# EAGLE design mainboard (EAGLE 9.6.2)
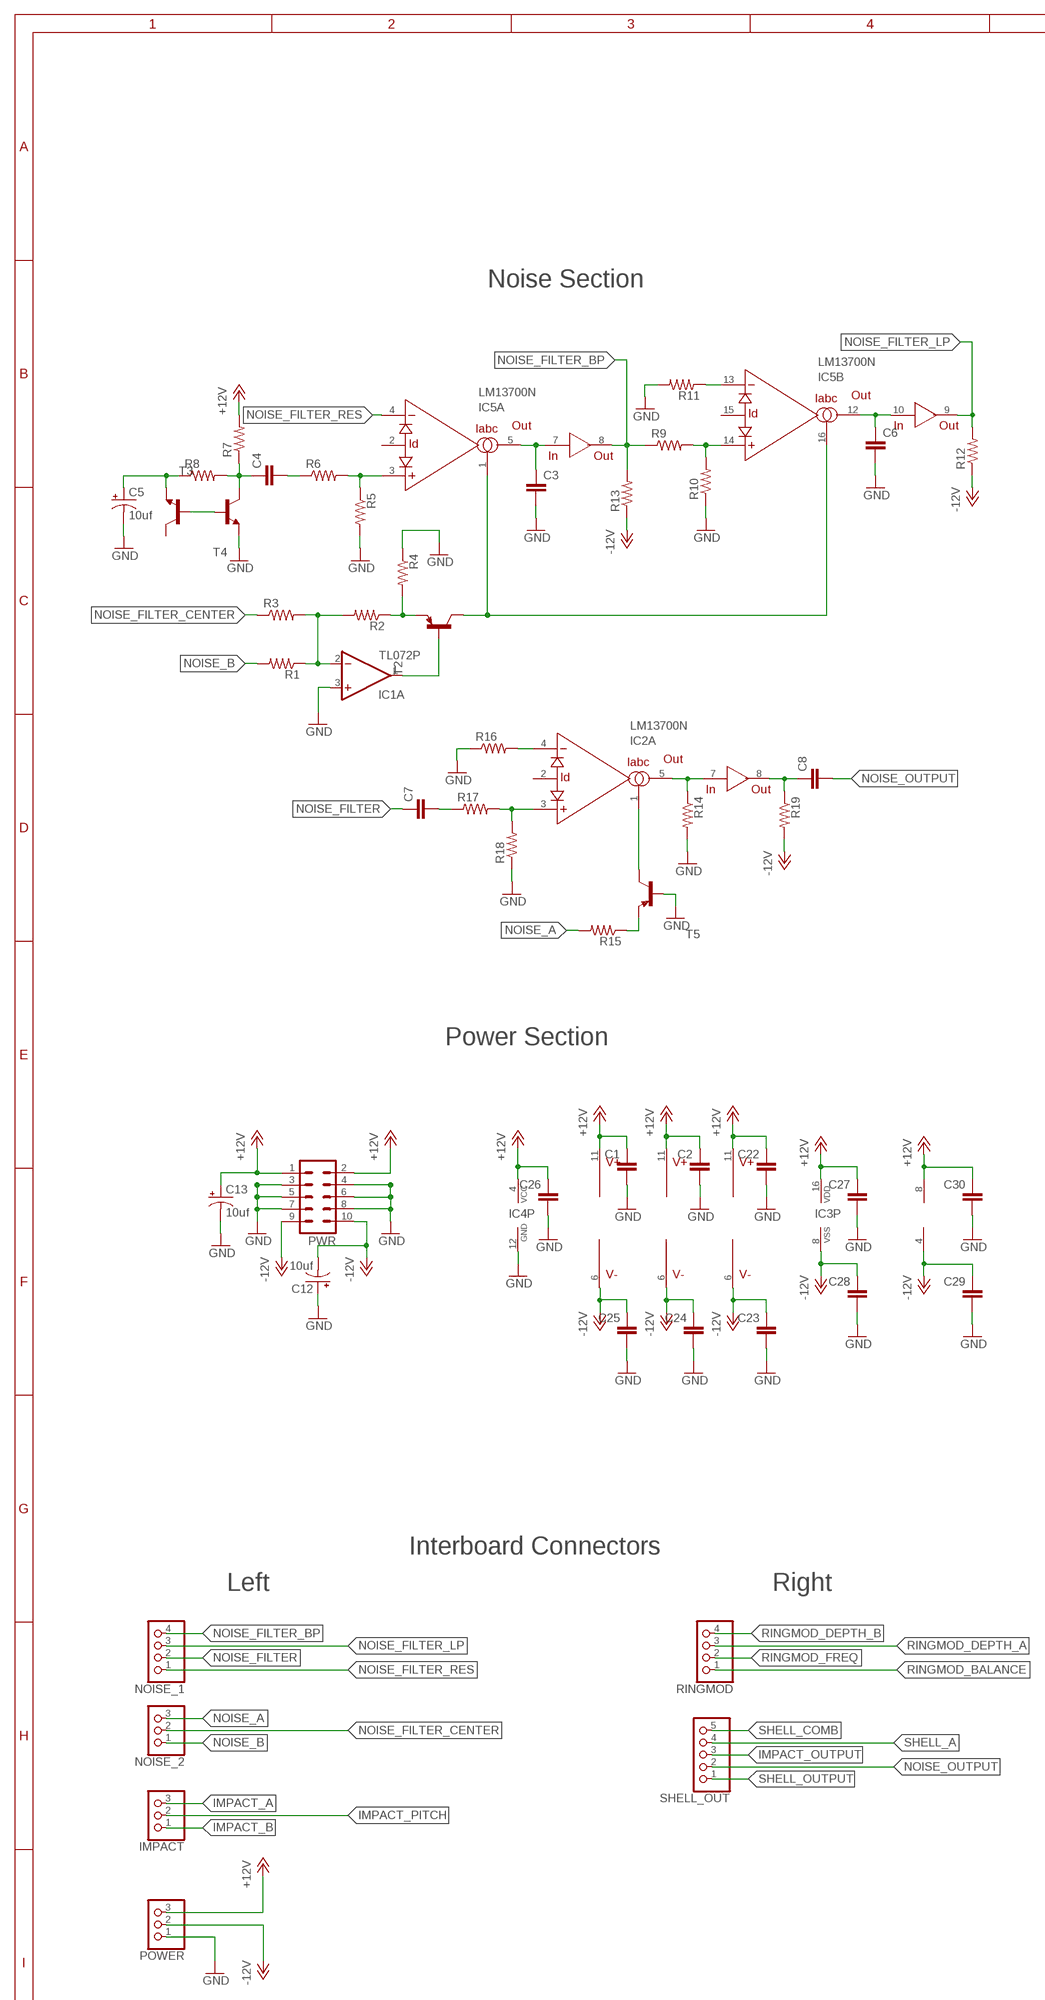
[diagram p0: schematic, sheet 1, part 1 of 2]
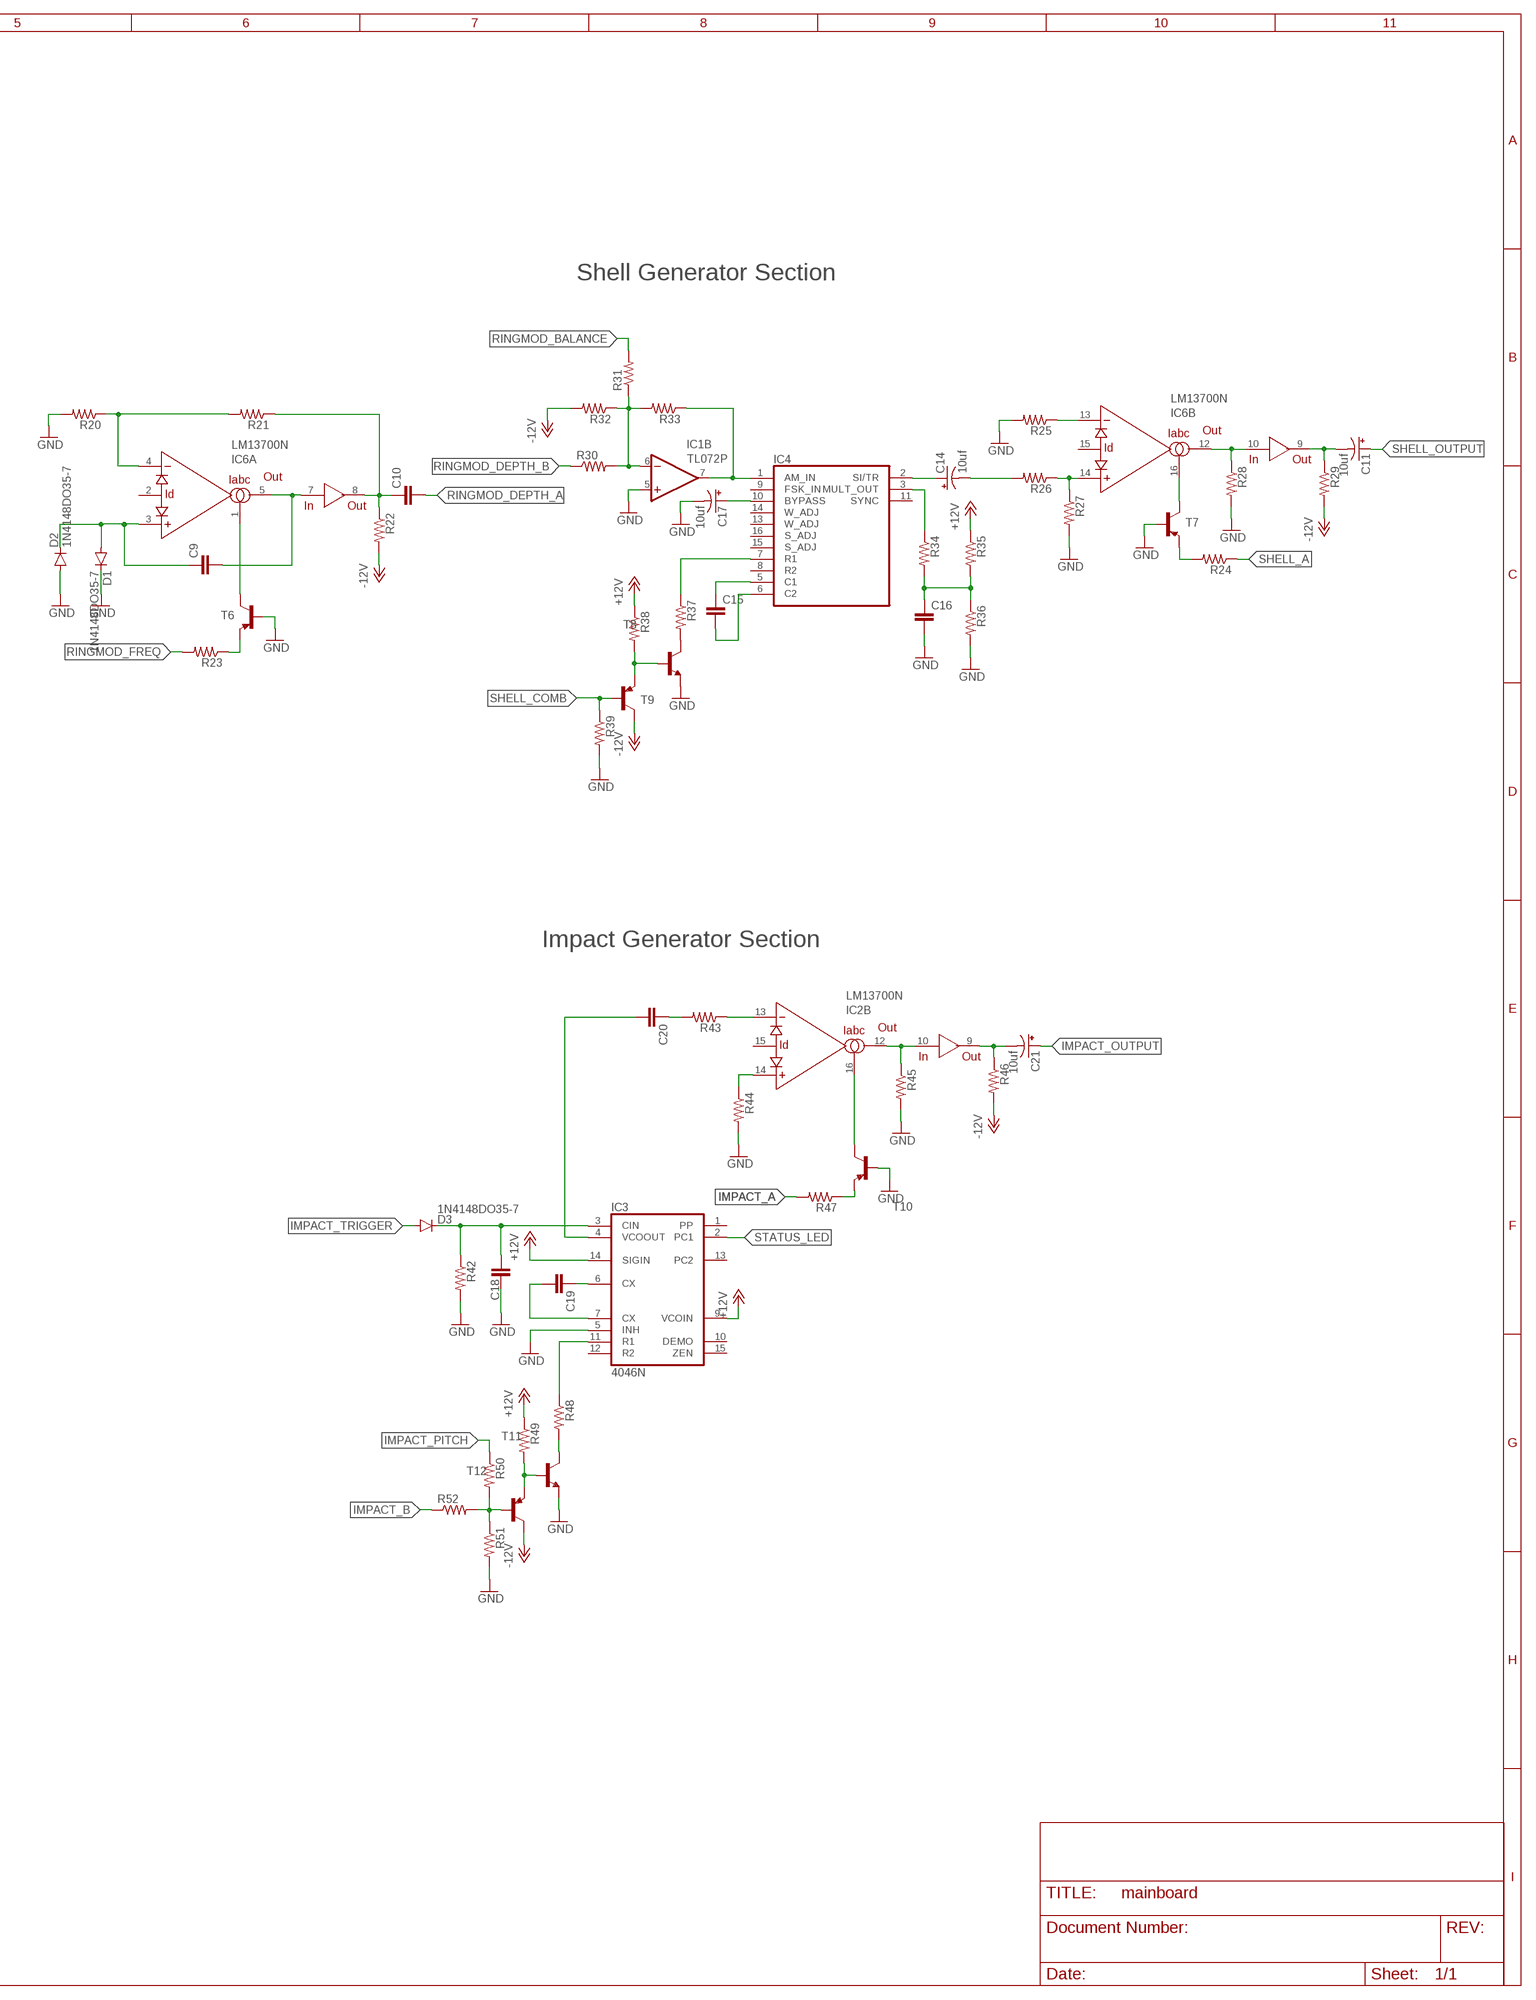
[diagram p1: schematic, sheet 1, part 2 of 2]

## Parts
C1  C-EU050-024X044  [C050-024X044]
C2  C-EU050-024X044  [C050-024X044]
C3  C-EU050-024X044  [C050-024X044]
C4  C-EU050-024X044  [C050-024X044]
C5  10uf  CPOL-USE2.5-5  [E2,5-5]
C6  C-EU050-024X044  [C050-024X044]
C7  C-EU050-024X044  [C050-024X044]
C8  C-EU050-024X044  [C050-024X044]
C9  C-EU050-024X044  [C050-024X044]
C10  C-EU050-024X044  [C050-024X044]
C11  10uf  CPOL-USE2.5-5  [E2,5-5]
C12  10uf  CPOL-USE2.5-5  [E2,5-5]
C13  10uf  CPOL-USE2.5-5  [E2,5-5]
C14  10uf  CPOL-USE2.5-5  [E2,5-5]
C15  C-EU050-024X044  [C050-024X044]
C16  C-EU050-024X044  [C050-024X044]
C17  10uf  CPOL-USE2.5-5  [E2,5-5]
C18  C-EU050-024X044  [C050-024X044]
C19  C-EU050-024X044  [C050-024X044]
C20  C-EU050-024X044  [C050-024X044]
C21  10uf  CPOL-USE2.5-5  [E2,5-5]
C22  C-EU050-024X044  [C050-024X044]
C23  C-EU050-024X044  [C050-024X044]
C24  C-EU050-024X044  [C050-024X044]
C25  C-EU050-024X044  [C050-024X044]
C26  C-EU050-024X044  [C050-024X044]
C27  C-EU050-024X044  [C050-024X044]
C28  C-EU050-024X044  [C050-024X044]
C29  C-EU050-024X044  [C050-024X044]
C30  C-EU050-024X044  [C050-024X044]
D1  1N4148DO35-7  [DO35-7]
D2  1N4148DO35-7  [DO35-7]
D3  1N4148DO35-7  [DO35-7]
IC1  TL072P  [DIL08]
IC2  LM13700N  [DIL16]
IC3  4046N  [DIL16]
IC4  XR-2206  [DIL16]
IC5  LM13700N  [DIL16]
IC6  LM13700N  [DIL16]
IMPACT  PINHD-1X3  [1X03]
NOISE_1  PINHD-1X4  [1X04]
NOISE_2  PINHD-1X3  [1X03]
POWER  PINHD-1X3  [1X03]
PWR  ML10  [ML10]
R1  R-US_0207/7  [0207/7]
R2  R-US_0207/7  [0207/7]
R3  R-US_0207/7  [0207/7]
R4  R-US_0207/7  [0207/7]
R5  R-US_0207/7  [0207/7]
R6  R-US_0207/7  [0207/7]
R7  R-US_0207/7  [0207/7]
R8  R-US_0207/7  [0207/7]
R9  R-US_0207/7  [0207/7]
R10  R-US_0207/7  [0207/7]
R11  R-US_0207/7  [0207/7]
R12  R-US_0207/7  [0207/7]
R13  R-US_0207/7  [0207/7]
R14  R-US_0207/7  [0207/7]
R15  R-US_0207/7  [0207/7]
R16  R-US_0207/7  [0207/7]
R17  R-US_0207/7  [0207/7]
R18  R-US_0207/7  [0207/7]
R19  R-US_0207/7  [0207/7]
R20  R-US_0207/7  [0207/7]
R21  R-US_0207/7  [0207/7]
R22  R-US_0207/7  [0207/7]
R23  R-US_0207/7  [0207/7]
R24  R-US_0207/7  [0207/7]
R25  R-US_0207/7  [0207/7]
R26  R-US_0207/7  [0207/7]
R27  R-US_0207/7  [0207/7]
R28  R-US_0207/7  [0207/7]
R29  R-US_0207/7  [0207/7]
R30  R-US_0207/7  [0207/7]
R31  R-US_0207/7  [0207/7]
R32  R-US_0207/7  [0207/7]
R33  R-US_0207/7  [0207/7]
R34  R-US_0207/7  [0207/7]
R35  R-US_0207/7  [0207/7]
R36  R-US_0207/7  [0207/7]
R37  R-US_0207/7  [0207/7]
R38  R-US_0207/7  [0207/7]
R39  R-US_0207/7  [0207/7]
R42  R-US_0207/7  [0207/7]
R43  R-US_0207/7  [0207/7]
R44  R-US_0207/7  [0207/7]
R45  R-US_0207/7  [0207/7]
R46  R-US_0207/7  [0207/7]
R47  R-US_0207/7  [0207/7]
R48  R-US_0207/7  [0207/7]
R49  R-US_0207/7  [0207/7]
R50  R-US_0207/7  [0207/7]
R51  R-US_0207/7  [0207/7]
R52  R-US_0207/7  [0207/7]
RINGMOD  PINHD-1X4  [1X04]
SHELL_OUT  PINHD-1X5  [1X05]
T2  2N3906-PNP-TO92-EBC  [TO92-EBC]
T3  2N3904-NPN-TO92-EBC  [TO92-EBC]
T4  2N3904-NPN-TO92-EBC  [TO92-EBC]
T5  2N3906-PNP-TO92-EBC  [TO92-EBC]
T6  2N3906-PNP-TO92-EBC  [TO92-EBC]
T7  2N3906-PNP-TO92-EBC  [TO92-EBC]
T8  2N3904-NPN-TO92-EBC  [TO92-EBC]
T9  2N3906-PNP-TO92-EBC  [TO92-EBC]
T10  2N3906-PNP-TO92-EBC  [TO92-EBC]
T11  2N3904-NPN-TO92-EBC  [TO92-EBC]
T12  2N3906-PNP-TO92-EBC  [TO92-EBC]

## Nets
+12V: C1.1 C2.1 C13.+ C22.1 C26.1 C27.1 C30.1 IC1.8(P:V+) IC2.11(V+) IC3.9(VCOIN) IC3.14(SIGIN) IC3.16(VDD) IC4.4(VCC) IC5.11(V+) IC6.11(V+) POWER.3 PWR.1 PWR.2 R7.2 R35.1 R38.1 R49.1
-12V: C12.- C23.1 C24.1 C25.1 C28.1 C29.1 IC1.4(P:V-) IC2.6(V-) IC3.8(VSS) IC5.6(V-) IC6.6(V-) POWER.2 PWR.9 PWR.10 R12.1 R13.1 R19.2 R22.2 R29.2 R32.2 R46.2 T9.C T12.C
GND: C1.2 C2.2 C3.2 C5.- C6.2 C12.+ C13.- C16.2 C17.- C18.1 C22.2 C23.2 C24.2 C25.2 C26.2 C27.2 C28.2 C29.2 C30.2 D1.C D2.A IC1.3(A:+IN) IC1.5(B:+IN) IC3.5(INH) IC4.12(GND) POWER.1 PWR.3 PWR.4 PWR.5 PWR.6 PWR.7 PWR.8 R4.1 R5.2 R10.1 R11.2 R14.2 R16.1 R18.1 R20.2 R25.2 R27.2 R28.2 R36.2 R39.2 R42.2 R44.2 R45.2 R51.2 T3.E T5.B T6.B T7.B T8.E T10.B T11.E
IMPACT_A: IMPACT.3 R47.2
IMPACT_B: IMPACT.1 R52.1
IMPACT_OUTPUT: C21.+ SHELL_OUT.3
IMPACT_PITCH: IMPACT.2 R50.1
IMPACT_TRIGGER: D3.A
N$1: IC1.2(A:-IN) R1.1 R2.2 R3.2
N$2: IC5.1(A:IABC) IC5.16(B:IABC) T2.C
N$3: IC1.1(A:OUT) T2.B
N$6: R2.1 R4.2 T2.E
N$7: C3.1 IC5.5(A:OUT) IC5.7(IN)
N$8: C5.+ R8.1 T4.E
N$9: C4.1 R7.1 R8.2 T3.C
N$10: T3.B T4.B
N$11: C4.2 R6.1
N$12: IC5.3(A:+IN) R5.1 R6.2
N$14: C6.1 IC5.10(IN) IC5.12(B:OUT)
N$16: IC5.14(B:+IN) R9.2 R10.2
N$17: IC5.13(B:-IN) R11.1
N$19: IC2.4(A:-IN) R16.2
N$20: IC2.3(A:+IN) R17.2 R18.2
N$21: C7.2 R17.1
N$23: IC2.1(A:IABC) T5.C
N$24: C9.1 D1.A D2.C IC6.3(A:+IN)
N$25: R15.1 T5.E
N$27: IC2.5(A:OUT) IC2.7(IN) R14.1
N$28: C8.1 IC2.8(OUT) R19.1
N$30: C9.2 IC6.5(A:OUT) IC6.7(IN)
N$31: C10.1 IC6.8(OUT) R21.1 R22.1
N$33: IC6.1(A:IABC) T6.C
N$34: R23.1 T6.E
N$35: IC6.4(A:-IN) R20.1 R21.2
N$38: IC1.6(B:-IN) R30.2 R31.1 R32.1 R33.2
N$40: IC1.7(B:OUT) IC4.1(AM_IN) R33.1
N$41: C14.+ IC4.2(SI/TR)
N$42: C14.- R26.2
N$43: IC6.14(B:+IN) R26.1 R27.1
N$44: IC6.13(B:-IN) R25.1
N$45: IC6.16(B:IABC) T7.C
N$46: IC6.10(IN) IC6.12(B:OUT) R28.1
N$47: R24.2 T7.E
N$49: C11.- IC6.9(OUT) R29.1
N$50: C15.2 IC4.6(C2)
N$52: C15.1 IC4.5(C1)
N$53: IC4.3(MULT_OUT) R34.1
N$54: C17.+ IC4.10(BYPASS)
N$55: C16.1 R34.2 R35.2 R36.1
N$56: IC4.7(R1) R37.1
N$57: R37.2 T8.C
N$59: R38.2 T8.B T9.E
N$62: C20.1 R43.2
N$63: IC2.13(B:-IN) R43.1
N$64: IC2.14(B:+IN) R44.1
N$65: IC2.10(IN) IC2.12(B:OUT) R45.1
N$66: IC2.16(B:IABC) T10.C
N$67: R50.2 R51.1 R52.2 T12.B
N$68: R47.1 T10.E
N$70: C21.- IC2.9(OUT) R46.1
N$72: C20.2 IC3.4(VCOOUT)
N$73: C19.1 IC3.6(CX)
N$74: C19.2 IC3.7(CX)
N$75: R49.2 T11.B T12.E
N$76: C18.2 D3.C IC3.3(CIN) R42.1
N$78: R48.2 T11.C
N$80: IC3.11(R1) R48.1
NOISE_A: NOISE_2.3 R15.2
NOISE_B: NOISE_2.1 R1.2
NOISE_FILTER: C7.1 NOISE_1.2
NOISE_FILTER_BP: IC5.8(OUT) NOISE_1.4 R9.1 R13.2
NOISE_FILTER_CENTER: NOISE_2.2 R3.1
NOISE_FILTER_LP: IC5.9(OUT) NOISE_1.3 R12.2
NOISE_FILTER_RES: IC5.4(A:-IN) NOISE_1.1
NOISE_OUTPUT: C8.2 SHELL_OUT.2
RINGMOD_BALANCE: R31.2 RINGMOD.1
RINGMOD_DEPTH_A: C10.2 RINGMOD.3
RINGMOD_DEPTH_B: R30.1 RINGMOD.4
RINGMOD_FREQ: R23.2 RINGMOD.2
SHELL_A: R24.1 SHELL_OUT.4
SHELL_COMB: R39.1 SHELL_OUT.5 T9.B
SHELL_OUTPUT: C11.+ SHELL_OUT.1
STATUS_LED: IC3.2(PC1)
Unconnected: IC2.2(A:ID) IC2.15(B:ID) IC3.1(PP) IC3.10(DEMO) IC3.12(R2) IC3.13(PC2) IC3.15(ZEN) IC4.8(R2) IC4.9(FSK_IN) IC4.11(SYNC) IC4.13(W_ADJ) IC4.14(W_ADJ) IC4.15(S_ADJ) IC4.16(S_ADJ) IC5.2(A:ID) IC5.15(B:ID) IC6.2(A:ID) IC6.15(B:ID) T4.C

## Notes on the sheet
- Noise Section | Shell Generator Section
- Impact Generator Section
- Power Section
- Interboard Connectors
- Left | Right

## Library data of the parts
C1-C4 C6-C10 C15 C16 C18-C20 C22-C30 = rcl:C-EU: CAPACITOR, European symbol; SPICEPREFIX: C
C5 C11-C14 C17 C21 = resistor:CPOL-US: POLARIZED CAPACITOR, American symbol
D1-D3 = diode:1N4148: DIODE high speed (Philips)
IC1 = TomW:TL072: OP AMP
IC2 IC5 IC6 = synthdiy:LM13700: National Dual OTA with buffers.
IC3 = 40xx:4046: Micropower PLL
IC4 = exar:XR-2206: Monolithic FUNCTION GENERATOR; OC_FARNELL: unknown; OC_NEWARK: unknown
IMPACT NOISE_2 POWER = pinhead:PINHD-1X3: PIN HEADER
NOISE_1 RINGMOD = pinhead:PINHD-1X4: PIN HEADER
PWR = con-ml:ML10: HARTING; OC_FARNELL: unknown; OC_NEWARK: unknown
R1-R39 R42-R52 = rcl:R-US_: RESISTOR, American symbol; SPICEPREFIX: R
SHELL_OUT = pinhead:PINHD-1X5: PIN HEADER
T2 T5-T7 T9 T10 T12 = transistor-neu-to92:*-PNP-: PNP Transistror
T3 T4 T8 T11 = transistor-neu-to92:*-NPN-: NPN Transistror

## Board
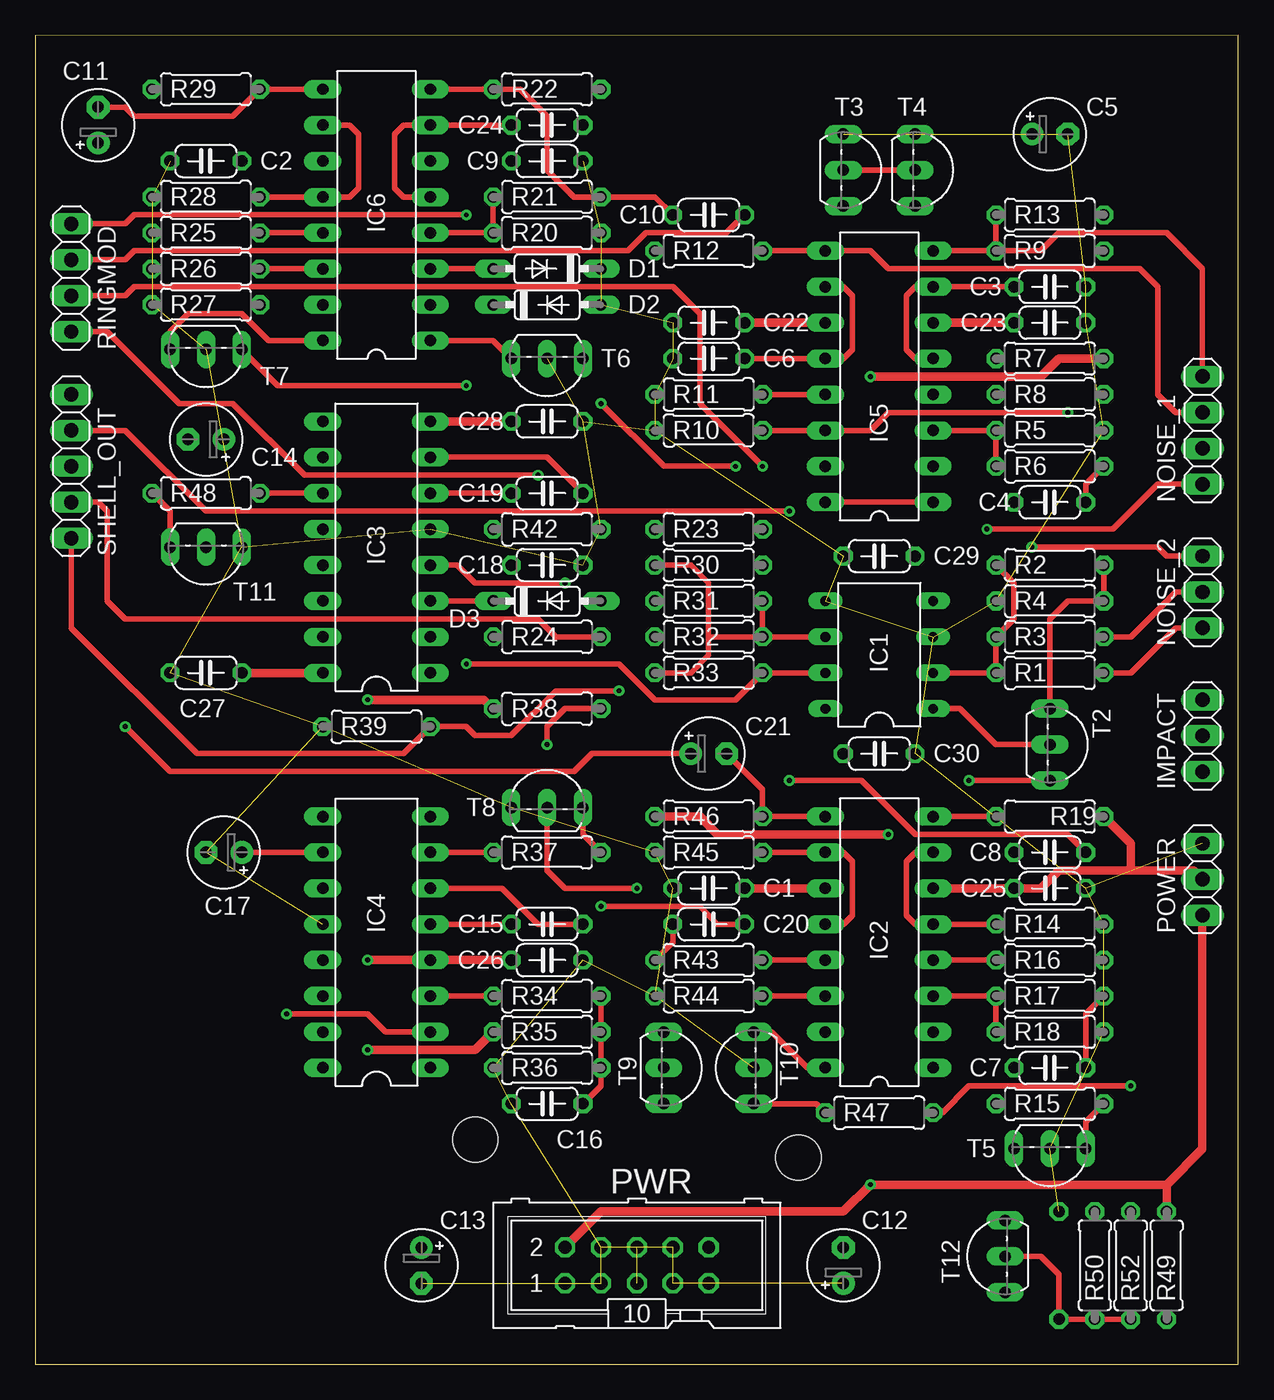
[diagram p2: board, top side]
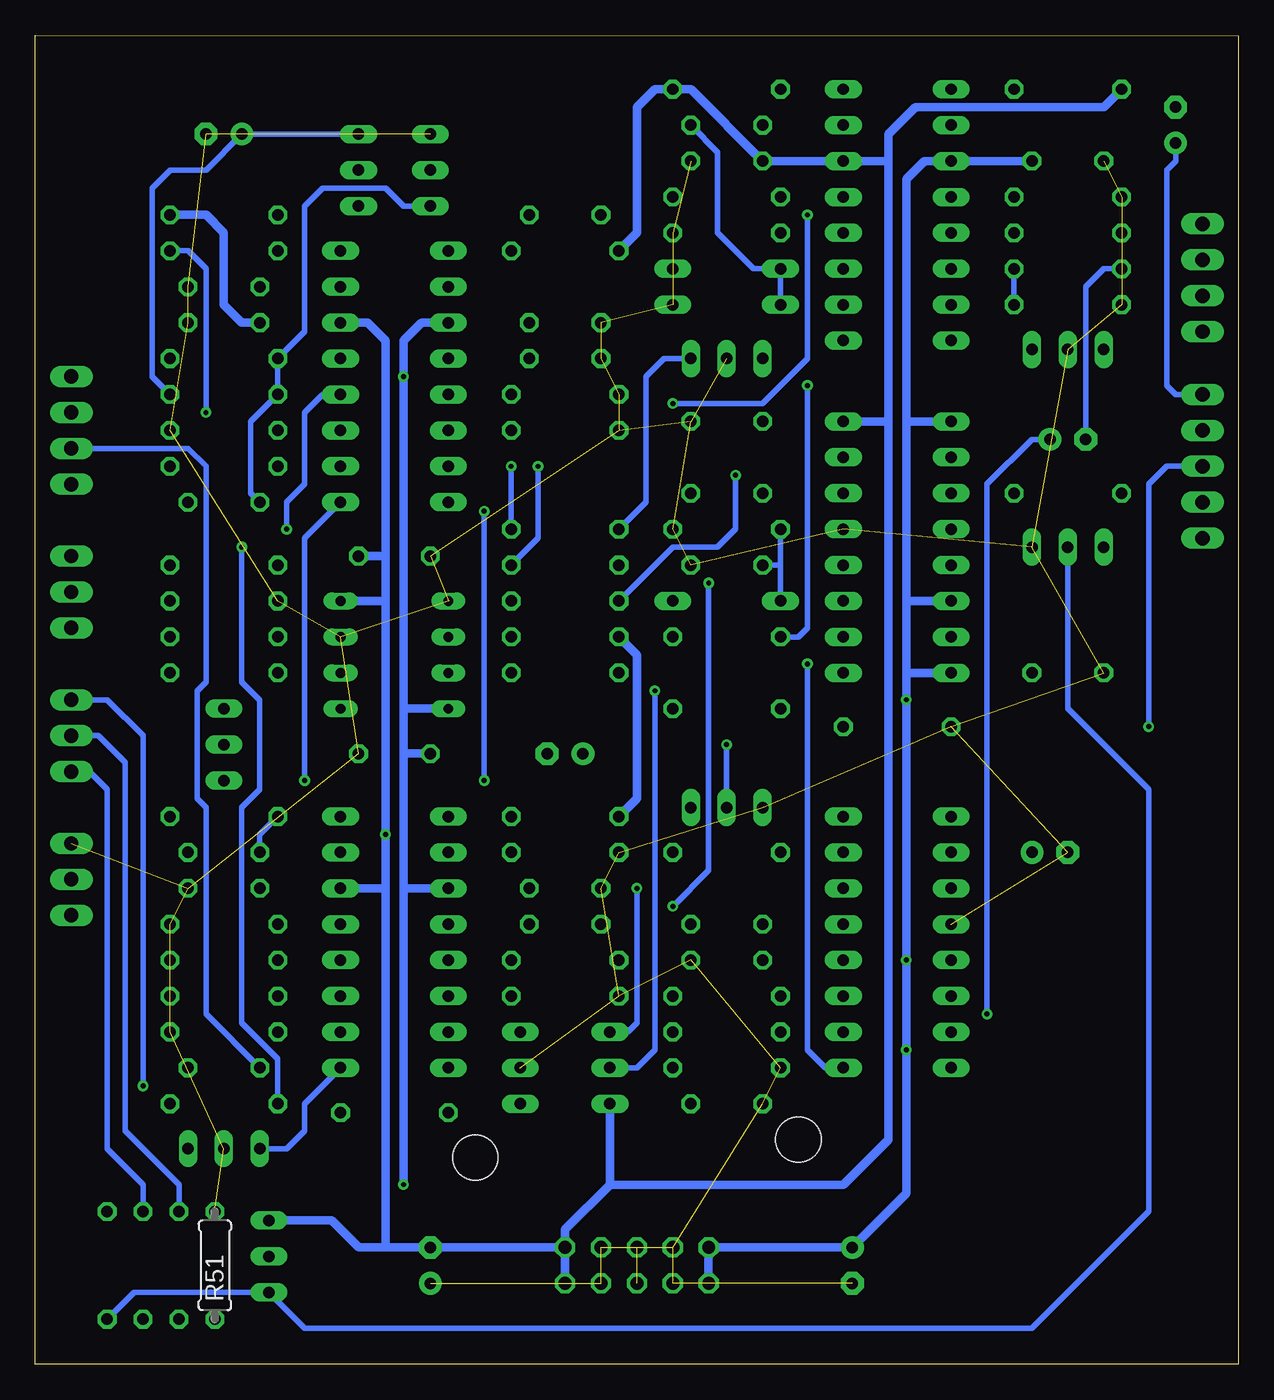
[diagram p3: board, bottom side, seen from below]

Size 85.09 x 93.98 mm. Coordinates in mm from the lower left corner, seen from the top.
Outline: 0,0 85.09,0 85.09,93.98 0,93.97 0,0
Copper layers (1*16): Top 0.035mm / dielectric 1.5mm / Bottom 0.035mm
Design rules "default": minimum track width 6mil, minimum drill 0.35mm, track to track 6mil, track to pad 6mil, pad to pad 6mil, via to via 6mil, smd to smd 6mil, copper to edge 40mil, drill to drill 6mil, minimum pad ring 10mil, minimum via ring 8mil, stop-mask expansion 4mil, vias tented up to drill 0mil, thermal gap 10mil
Holes 3.2 mm at 31.11,15.88 53.98,14.61

### Footprints (pad centres in the part's own frame; a part is rotated, then mirrored left to right if it is on the bottom)
C050-024X044 = drill 0.813 octagon: 1 -2.54,0; 2 2.54,0
E2,5-5 = drill 0.813 pad 1.6: + -1.27,0 | drill 0.813 pad 1.6 octagon: - 1.27,0
DO35-7 = drill 0.813 long: A 3.81,0; C -3.81,0
DIL08 = drill 0.7 long: 1 -3.81,-3.81; 2 -1.27,-3.81; 3 1.27,-3.81; 4 3.81,-3.81; 5 3.81,3.81; 6 1.27,3.81; 7 -1.27,3.81; 8 -3.81,3.81
DIL16 = drill 0.813 long: 1 -8.89,-3.81; 2 -6.35,-3.81; 3 -3.81,-3.81; 4 -1.27,-3.81; 5 1.27,-3.81; 6 3.81,-3.81; 7 6.35,-3.81; 8 8.89,-3.81; 9 8.89,3.81; 10 6.35,3.81; 11 3.81,3.81; 12 1.27,3.81; 13 -1.27,3.81; 14 -3.81,3.81; 15 -6.35,3.81; 16 -8.89,3.81
1X03 = drill 1.016 long: 1 -2.54,0; 2 0,0; 3 2.54,0
1X04 = drill 1.016 long: 1 -3.81,0; 2 -1.27,0; 3 1.27,0; 4 3.81,0
ML10 = drill 0.914 octagon: 1 -5.08,-1.27; 2 -5.08,1.27; 3 -2.54,-1.27; 4 -2.54,1.27; 5 0,-1.27; 6 0,1.27; 7 2.54,-1.27; 8 2.54,1.27; 9 5.08,-1.27; 10 5.08,1.27
0207/7 = drill 0.813 octagon: 1 -3.81,0; 2 3.81,0
1X05 = drill 1.016 long: 1 -5.08,0; 2 -2.54,0; 3 0,0; 4 2.54,0; 5 5.08,0
TO92-EBC = drill 0.813 long: B 0,-1.27; C 2.54,-1.27; E -2.54,-1.27

### Placement (x,y rotation side)
C1  47.62,33.66 180 top
C2  12.06,85.09 180 top
C3  71.75,76.2 0 top
C4  71.75,60.96 0 top
C5  71.75,87 0 top
C6  47.62,71.12 180 top
C7  71.75,20.95 0 top
C8  71.75,36.2 0 top
C9  36.2,87.63 180 top
C10  47.62,81.28 0 top
C11  4.45,87.63 90 top
C12  57.15,6.99 90 top
C13  27.3,6.99 270 top
C14  12.06,65.41 180 top
C15  36.2,31.11 0 top
C16  36.2,18.41 180 top
C17  13.34,36.2 180 top
C18  36.2,56.52 180 top
C19  36.2,61.59 0 top
C20  47.62,31.11 0 top
C21  47.62,43.18 0 top
C22  47.62,73.66 180 top
C23  71.75,73.66 0 top
C24  36.2,85.09 0 top
C25  71.75,33.66 0 top
C26  36.2,28.57 0 top
C27  12.06,48.9 180 top
C28  36.2,66.67 0 top
C29  59.69,57.15 180 top
C30  59.69,43.18 0 top
D1  36.2,77.47 180 top
D2  36.2,74.93 0 top
D3  36.2,53.98 0 top
IC1  59.69,50.16 90 top
IC2  59.69,29.84 90 top
IC3  24.13,57.78 90 top
IC4  24.13,29.84 90 top
IC5  59.69,69.85 90 top
IC6  24.13,81.28 90 top
IMPACT  82.55,44.45 90 top
NOISE_1  82.55,66.04 90 top
NOISE_2  82.55,54.61 90 top
POWER  82.55,34.29 270 top
PWR  42.55,6.99 0 top
R1  71.75,48.9 0 top
R2  71.75,56.52 180 top
R3  71.75,51.44 180 top
R4  71.75,53.98 0 top
R5  71.75,66.04 0 top
R6  71.75,63.5 180 top
R7  71.75,71.12 0 top
R8  71.75,68.58 180 top
R9  71.75,78.74 0 top
R10  47.62,66.04 0 top
R11  47.62,68.58 180 top
R12  47.62,78.74 0 top
R13  71.75,81.28 180 top
R14  71.75,31.11 0 top
R15  71.75,18.41 180 top
R16  71.75,28.57 180 top
R17  71.75,26.04 180 top
R18  71.75,23.5 180 top
R19  71.75,38.73 0 top
R20  36.2,80.01 0 top
R21  36.2,82.55 180 top
R22  36.2,90.17 0 top
R23  47.62,59.05 0 top
R24  36.2,51.44 180 top
R25  12.06,80.01 180 top
R26  12.06,77.47 180 top
R27  12.06,74.93 180 top
R28  12.06,82.55 180 top
R29  12.06,90.17 180 top
R30  47.62,56.52 180 top
R31  47.62,53.98 180 top
R32  47.62,51.44 180 top
R33  47.62,48.9 180 top
R34  36.2,26.04 0 top
R35  36.2,23.5 0 top
R36  36.2,20.95 180 top
R37  36.2,36.2 0 top
R38  36.2,46.35 0 top
R39  24.13,45.09 180 top
R42  36.2,59.05 0 top
R43  47.62,28.57 180 top
R44  47.62,26.04 180 top
R45  47.62,36.2 180 top
R46  47.62,38.73 180 top
R47  59.69,17.78 0 top
R48  12.06,61.59 180 top
R49  80.01,6.99 270 top
R50  74.93,6.99 270 top
R51  72.39,6.99 90 bottom
R52  77.47,6.99 270 top
RINGMOD  2.54,76.83 90 top
SHELL_OUT  2.54,63.5 270 top
T2  73.03,43.81 270 top
T3  58.42,84.45 270 top
T4  63.5,84.45 270 top
T5  71.75,13.97 180 top
T6  36.2,69.85 180 top
T7  12.06,70.48 180 top
T8  36.2,40.64 0 top
T9  45.72,20.95 270 top
T10  49.53,20.95 90 top
T11  12.06,56.52 180 top
T12  67.31,7.62 90 top

### Tracks (layer width: path | path; a pad name or v marks a point on that pad's centre or on a via)
+12V  (via drill 0.35)
  Top 0.61: IC5.11 C22.1 | C26.1 IC4.4 v23.5,28.57 | C1.1 IC2.11 | PWR.2 40.01,10.79 57.15,10.79 v59.05,12.7 80.01,12.7 | IC3.16 C27.1 | R35.1 31.11,22.23 v23.5,22.23 | R7.2 72.39,71.12 71.12,69.85 v59.05,69.85 | R38.1 31.75,46.99 v23.5,46.99 | POWER.3 82.55,15.24 80.01,12.7 | R49.1 80.01,12.7
  Bottom 0.61: C2.1 IC6.11 22.23,85.09 23.5,83.82 23.5,66.67 | IC5.11 57.78,73.66 59.05,72.39 v59.05,69.85 59.05,46.35 | v59.05,12.7 59.05,33.66 | 59.05,33.66 59.05,43.18 | 59.05,43.18 59.05,46.35 | 59.05,43.18 C30.1 | IC1.8 59.05,46.35 | PWR.1 PWR.2 C13.+ 23.5,12.06 v23.5,22.23 v23.5,28.57 v23.5,46.99 23.5,48.9 | 23.5,48.9 23.5,53.98 | 23.5,53.98 23.5,66.67 | 23.5,66.67 IC3.9 | 23.5,53.98 IC3.14 | 23.5,48.9 IC3.16 | IC2.11 59.05,33.66
-12V  (via drill 0.35)
  Top 0.61: C23.1 IC5.6 | IC2.6 C25.1 71.12,33.66 72.39,34.92 77.47,34.92 | C28.1 IC3.8 | R46.2 46.99,38.73 48.26,37.47 v60.33,37.47 | R19.2 77.47,36.83 77.47,34.92 | 77.47,34.92 81.92,34.92 POWER.2
  Bottom 0.61: PWR.9 PWR.10 | PWR.10 C12.- 60.33,8.26 | 60.33,8.26 60.33,33.66 | 60.33,33.66 v60.33,37.47 60.33,53.98 | 60.33,53.98 60.33,57.15 | 60.33,57.15 60.33,72.39 61.59,73.66 IC5.6 | 60.33,33.66 IC2.6 | IC1.4 60.33,53.98 | C29.1 60.33,57.15 | 44.45,12.7 T9.C | PWR.10 47.62,9.53 44.45,12.7 | 44.45,12.7 27.94,12.7 24.77,15.88 24.77,66.67 | 24.77,66.67 IC3.8 | 24.77,66.67 24.77,85.09 | 24.77,85.09 IC6.6 C24.1 38.73,90.17 R22.2 41.27,90.17 42.55,88.9 42.55,80.01 R12.1 | R32.2 42.55,50.16 42.55,40.01 R46.2 | 24.77,85.09 24.77,87 22.86,88.9 9.53,88.9 R29.2 | R13.1 73.03,81.28 71.75,80.01 71.75,74.93 70.48,73.66 C23.1 | T12.C 64.14,10.16 62.23,8.26 60.33,8.26
GND  (55 unrouted)
IMPACT_A  (via drill 0.35)
  Top 0.406: v77.47,19.68 66.04,19.68 64.14,17.78 R47.2
  Bottom 0.406: IMPACT.3 80.01,46.99 77.47,44.45 v77.47,19.68
IMPACT_B
  Bottom 0.406: IMPACT.1 81.28,41.91 80.01,40.64 80.01,15.24 77.47,12.7 R52.1
IMPACT_OUTPUT  (via drill 0.35)
  Top 0.406: v6.35,45.09 9.53,41.91 38.1,41.91 39.37,43.18 C21.+
  Bottom 0.406: SHELL_OUT.3 5.08,63.5 6.35,62.23 v6.35,45.09
IMPACT_PITCH
  Bottom 0.406: R50.1 74.93,12.7 78.74,16.51 78.74,42.55 80.64,44.45 IMPACT.2
N$1
  Top 0.406: IC1.2 R1.1 R3.2 69.22,52.7 69.22,55.24 R2.2
N$2  (via drill 0.35)
  Top 0.406: IC5.16 IC5.1 | T2.C v66.04,41.27
  Bottom 0.406: v66.04,41.27 66.04,58.42 IC5.1
N$3
  Top 0.406: IC1.1 65.41,46.35 67.94,43.81 T2.B
N$6
  Top 0.406: R2.1 R4.2 73.03,53.98 71.75,52.7 T2.E
N$7
  Top 0.406: C3.1 IC5.7 | 62.87,76.2 IC5.7 | IC5.5 62.23,71.12 61.59,71.75 61.59,75.56 62.23,76.2 IC5.7
N$8
  Bottom 0.406: T4.E C5.+ 73.03,84.45 75.56,84.45 76.83,83.19 76.83,69.85 R8.1
N$9
  Bottom 0.406: C4.1 69.85,61.59 69.85,66.67 R8.2 R7.1 66.04,73.03 66.04,81.92 64.77,83.19 60.33,83.19 59.05,81.92 T3.C
N$10
  Top 0.406: T4.B T3.B
N$11
  Top 0.406: R6.1 74.3,62.23 C4.2
N$12
  Top 0.406: IC5.3 R5.1 R6.2
N$14
  Top 0.406: C6.1 IC5.12 57.15,71.12 57.78,71.75 57.78,75.56 57.15,76.2 IC5.10
N$16  (via drill 0.35)
  Top 0.406: R10.2 IC5.14 59.05,66.04 60.33,67.31 v73.03,67.31
  Bottom 0.406: v73.03,67.31 73.03,77.47 74.3,78.74 R9.2
N$17
  Top 0.406: R11.1 IC5.13
N$19
  Top 0.406: R16.2 IC2.4
N$20
  Top 0.406: IC2.3 R17.2 R18.2
N$21
  Top 0.406: C7.2 74.3,24.77 R17.1
N$23
  Bottom 0.406: IC2.1 66.04,18.41 66.04,16.51 67.31,15.24 T5.C
N$24
  Top 0.406: D1.A IC6.3
  Bottom 0.406: D2.C D1.A 34.29,77.47 36.83,80.01 36.83,85.72 C9.1
N$25
  Top 0.406: T5.E 74.3,17.14 R15.1
N$27
  Top 0.406: R14.1 IC2.5 62.23,31.11 61.59,31.75 61.59,35.56 62.23,36.2 IC2.7
N$28
  Top 0.406: R19.1 IC2.8
  Bottom 0.406: C8.1 69.22,37.47 R19.1
N$30
  Top 0.406: C9.2 IC6.7 26.04,87.63 25.4,87 25.4,83.19 26.04,82.55 IC6.5
N$31
  Top 0.406: IC6.8 R22.1 34.29,90.17 36.2,88.27 36.2,84.45 38.1,82.55 R21.1 43.81,82.55 C10.1
N$33
  Top 0.406: T6.C 32.38,72.39 IC6.1
N$34
  Bottom 0.406: R23.1 41.91,60.96 41.91,69.85 40.64,71.12 T6.E
N$35
  Top 0.406: IC6.4 R20.1 R21.2
N$38
  Top 0.406: R32.1 IC1.6 | R31.1 R32.1 | R33.2 46.35,48.9 47.62,50.16 47.62,51.44 | 47.62,51.44 R32.1 | R30.2 46.35,56.52 47.62,55.24 47.62,51.44
N$40  (via drill 0.35)
  Top 0.406: IC1.7 R33.1 49.53,46.99 43.81,46.99 41.27,49.53 v30.48,49.53
  Bottom 0.406: IC4.1 29.21,20.95 30.48,22.23 v30.48,49.53
N$41  (via drill 0.35)
  Top 0.406: v17.78,24.77 23.5,24.77 24.77,23.5 IC4.2
  Bottom 0.406: C14.+ 14.61,65.41 17.78,62.23 v17.78,24.77
N$42
  Bottom 0.406: R26.2 9.53,77.47 10.79,76.2 C14.-
N$43
  Top 0.406: R26.1 IC6.14
  Bottom 0.406: R26.1 R27.1
N$44
  Top 0.406: R25.1 IC6.13
N$45
  Top 0.406: T7.C 9.53,73.03 10.79,74.3 14.61,74.3 16.51,72.39 IC6.16
N$46
  Top 0.406: R28.1 IC6.12 22.23,82.55 22.86,83.19 22.86,87 22.23,87.63 IC6.10
N$47  (via drill 0.35)
  Top 0.406: v30.48,69.22 17.14,69.22 T7.E
  Bottom 0.406: R24.2 31.11,51.44 30.48,52.07 v30.48,69.22
N$49
  Top 0.406: IC6.9 R29.1 13.97,88.27 6.99,88.27 6.35,88.9 C11.-
N$50
  Top 0.406: IC4.6 33.02,33.66 35.56,31.11 C15.2
N$52
  Top 0.406: IC4.5 C15.1
N$53
  Top 0.406: IC4.3 R34.1
N$54
  Top 0.406: IC4.10 C17.+
N$55
  Top 0.406: R34.2 R35.2 R36.1 40.01,19.68 C16.1
N$56
  Top 0.406: IC4.7 R37.1
N$57
  Top 0.406: R37.2 38.73,37.47 T8.C
N$59  (via drill 0.35)
  Top 0.406: R38.2 37.47,46.35 36.2,45.09 v36.2,43.81 | T8.B 36.2,34.92 37.47,33.66 v42.55,33.66
  Bottom 0.406: v36.2,43.81 T8.B | T9.E 43.18,23.5 42.55,24.13 v42.55,33.66
N$62
  Top 0.406: R43.2 45.09,29.84 C20.1
N$63
  Top 0.406: IC2.13 R43.1
N$64
  Top 0.406: IC2.14 R44.1
N$65
  Top 0.406: R45.1 IC2.10 57.15,36.2 57.78,35.56 57.78,31.75 57.15,31.11 IC2.12
N$66
  Top 0.406: IC2.16 54.61,20.95 52.07,23.5 T10.C
N$67
  Top 0.406: R52.2 R50.2 R51.1 72.39,6.35 71.12,7.62 T12.B
N$68
  Top 0.406: T10.E 55.24,18.41 R47.1
N$70
  Top 0.406: IC2.9 R46.1 51.44,40.64 C21.-
N$72  (via drill 0.35)
  Top 0.406: C20.2 48.26,31.11 46.99,32.38 v40.01,32.38 | IC3.4 29.84,56.52 31.11,55.24 v37.47,55.24
  Bottom 0.406: v40.01,32.38 37.47,34.92 v37.47,55.24
N$73
  Top 0.406: IC3.6 C19.1
N$74
  Top 0.406: C19.2 36.2,64.14 IC3.7
N$75
  Bottom 0.406: R49.2 78.11,5.08 T12.E 66.04,2.54 14.61,2.54 6.35,10.79 6.35,40.64 12.06,46.35 T11.B
N$76
  Top 0.406: D3.C IC3.3
  Bottom 0.406: 32.38,56.52 D3.C | R42.1 32.38,56.52 | 32.38,56.52 C18.2
N$78
  Top 0.406: T11.C 9.53,60.33 R48.2
N$80
  Top 0.406: IC3.11 R48.1
NOISE_A  (via drill 0.35)
  Top 0.406: NOISE_2.3 80.01,57.15 79.38,57.78 v70.48,57.78
  Bottom 0.406: v70.48,57.78 70.48,48.26 69.22,46.99 69.22,40.64 70.48,39.37 70.48,24.13 67.94,21.59 R15.2
NOISE_B
  Top 0.406: R1.2 77.47,48.9 80.64,52.07 NOISE_2.1
NOISE_FILTER
  Bottom 0.406: C7.1 73.03,24.77 73.03,39.37 73.66,40.01 73.66,47.62 73.03,48.26 73.03,63.5 74.3,64.77 NOISE_1.2
NOISE_FILTER_BP
  Top 0.406: IC5.8 R9.1 | R13.2 R9.1 | R9.1 71.12,78.74 72.39,80.01 80.01,80.01 82.55,77.47 NOISE_1.4
NOISE_FILTER_CENTER
  Top 0.406: NOISE_2.2 80.64,54.61 77.47,51.44 R3.1
NOISE_FILTER_LP
  Top 0.406: R12.2 IC5.9 59.05,78.74 60.33,77.47 78.11,77.47 79.38,76.2 79.38,68.58 80.64,67.31 NOISE_1.3
NOISE_FILTER_RES  (via drill 0.35)
  Top 0.406: v67.31,59.05 76.2,59.05 79.38,62.23 NOISE_1.1
  Bottom 0.406: IC5.4 64.77,68.58 66.04,67.31 66.04,62.23 67.31,60.96 v67.31,59.05
NOISE_OUTPUT  (via drill 0.35)
  Top 0.406: v53.34,60.33 12.06,60.33 6.35,66.04 SHELL_OUT.2 | v53.34,41.27 58.42,41.27 62.23,37.47 73.03,37.47 C8.2
  Bottom 0.406: v53.34,60.33 v53.34,41.27
RINGMOD_BALANCE  (via drill 0.35)
  Top 0.406: RINGMOD.1 5.08,73.03 10.16,67.94 13.97,67.94 19.05,62.87 v35.56,62.87
  Bottom 0.406: v35.56,62.87 35.56,59.05 36.83,57.78 40.01,57.78 R31.2
RINGMOD_DEPTH_A
  Top 0.406: RINGMOD.3 6.35,78.11 6.99,78.74 41.91,78.74 43.18,80.01 48.9,80.01 C10.2
RINGMOD_DEPTH_B  (via drill 0.35)
  Top 0.406: v30.48,81.28 6.99,81.28 6.35,80.64 RINGMOD.4 | v49.53,63.5 44.45,63.5 v40.01,67.94
  Bottom 0.406: v30.48,81.28 30.48,71.12 33.66,67.94 v40.01,67.94 | v49.53,63.5 49.53,58.42 R30.1
RINGMOD_FREQ  (via drill 0.35)
  Top 0.406: RINGMOD.2 6.35,75.56 6.99,76.2 45.09,76.2 46.99,74.3 46.99,67.94 v51.44,63.5
  Bottom 0.406: v51.44,63.5 R23.2
SHELL_A
  Top 0.406: SHELL_OUT.4 4.45,60.96 5.08,60.33 5.08,53.98 6.35,52.7 35.56,52.7 36.83,51.44 R24.1
SHELL_COMB  (via drill 0.35)
  Top 0.406: v41.27,47.62 36.83,47.62 33.66,44.45 31.11,44.45 30.48,45.09 R39.1 26.04,43.18 11.43,43.18 2.54,52.07 SHELL_OUT.5
  Bottom 0.406: T9.B 42.55,20.95 41.27,22.23 v41.27,47.62
SHELL_OUTPUT
  Bottom 0.406: SHELL_OUT.1 4.45,68.58 5.08,69.22 5.08,84.45 4.45,85.09 C11.+